# Altium schematic sheet Audio.SchDoc
size A4; SheetNumber: 3; SheetTotal: 7
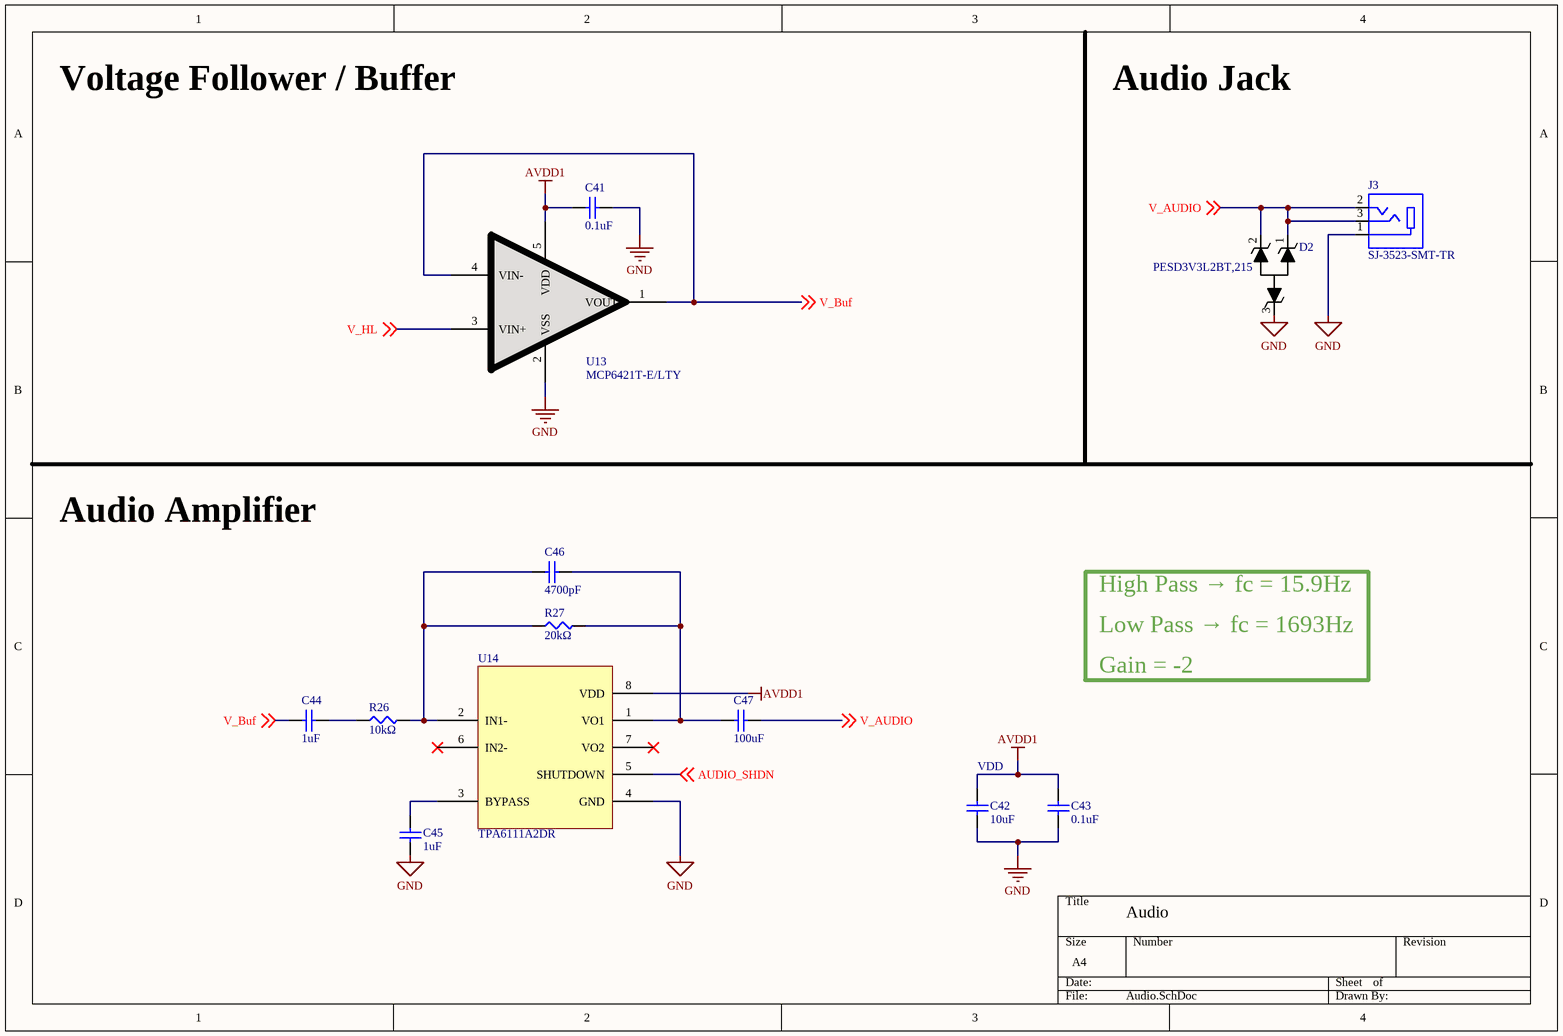
[diagram p0: Audio.SchDoc]

## Parts
C41  0.1uF  [0402]
C42  10uF  [0603]
C43  0.1uF  [0402]
C44  1uF  [0402]
C45  1uF  [0402]
C46  4700pF  [0402]
C47  100uF  [1206]
D2  PESD3V3L2BT,215  [SOT-23-3]
J3  SJ-3523-SMT-TR  [CUI_SJ-3523-SMT-TR]
R26  10kΩ  [0402]
R27  20kΩ  [0402]
U13  MCP6421T-E/LTY  [SC-70-5]
U14  TPA6111A2DR  [SOIC-8]

## Nets
AVDD1: C41.1 C42.2 C43.1 U13.5(VDD) U14.8(VDD)
GND: C41.2 C42.1 C43.2 C45.1 D2.3 J3.1 U13.2(VSS) U14.4(GND)
AUDIO_SHDN: U14.5(SHUTDOWN) ; off-sheet AUDIO_SHDN
V_AUDIO: C47.2 D2.1 D2.2 J3.2 J3.3 ; off-sheet V_AUDIO
V_Buf: C44.1 U13.1(VOUT) U13.4(VIN-) ; off-sheet V_Buf
V_HL: U13.3(VIN+) ; off-sheet V_HL
NetC44_2: C44.2 R26.1
NetC45_2: C45.2 U14.3(BYPASS)
NetC46_1: C46.1 R26.2 R27.1 U14.2(IN1-)
NetC46_2: C46.2 C47.1 R27.2 U14.1(VO1)

Not connected (* = marked no-connect by the designer): U14 6(IN2-)* 7(VO2)*

## Notes on the sheet
- Voltage Follower / Buffer
- Audio Jack
- Audio Amplifier
- High Pass → fc = 15.9Hz
- Low Pass → fc = 1693Hz
- Gain = -2
- (near C42) VDD
- Audio

## Library data of the parts
C41 C43-C46 = 0402: MLCC-0402
C42 = 0603: MLCC-0603
C47 = 1206: MLCC-1206
D2 = PESD3V3L2BT,215: ESD Suppressors / TVS Diodes, 2 Channl. Breakdown 6.4V, Clamping Voltage 8V
J3 = SJ-3523-SMT-TR: 3.5 mm, Stereo, Right Angle, Surface Mount _SMT_, Audio Jack Connector; MF: CUI Devices; Package: LGA-10 STMicroelectronics; CUI_purchase_URL: https://www.cuidevices.com/product/interconnect/connectors/audio-connectors/jacks/sj-352x-smt-series?utm_source=snapeda.com&utm_medium=referral&utm_campaign=snapedaBOM; Value: *; Price: None; MP: SJ-3523-SMT-TR; Availability: Unavailable; SnapEDA_Link: https://www.snapeda.com/parts/SJ-3523-SMT-TR/CUI%20Devices/view-part/251570/?ref=snap
R26 R27 = 0402: Resistor_SMD_0402; AuthorBy: yjlab
U13 = MCP6421T-E/LTY: 4.4 µA/Amplifier, 90 kHz Op Amp
U14 = TPA6111A2DR: Audio Power Amp